# Altium schematic sheet Connectors.SchDoc: Extension connectors
size A3; DocumentNumber: MB1312; Revision: A-01; SheetNumber: 5; SheetTotal: 6; Project: NUCLEO-LXXXZX
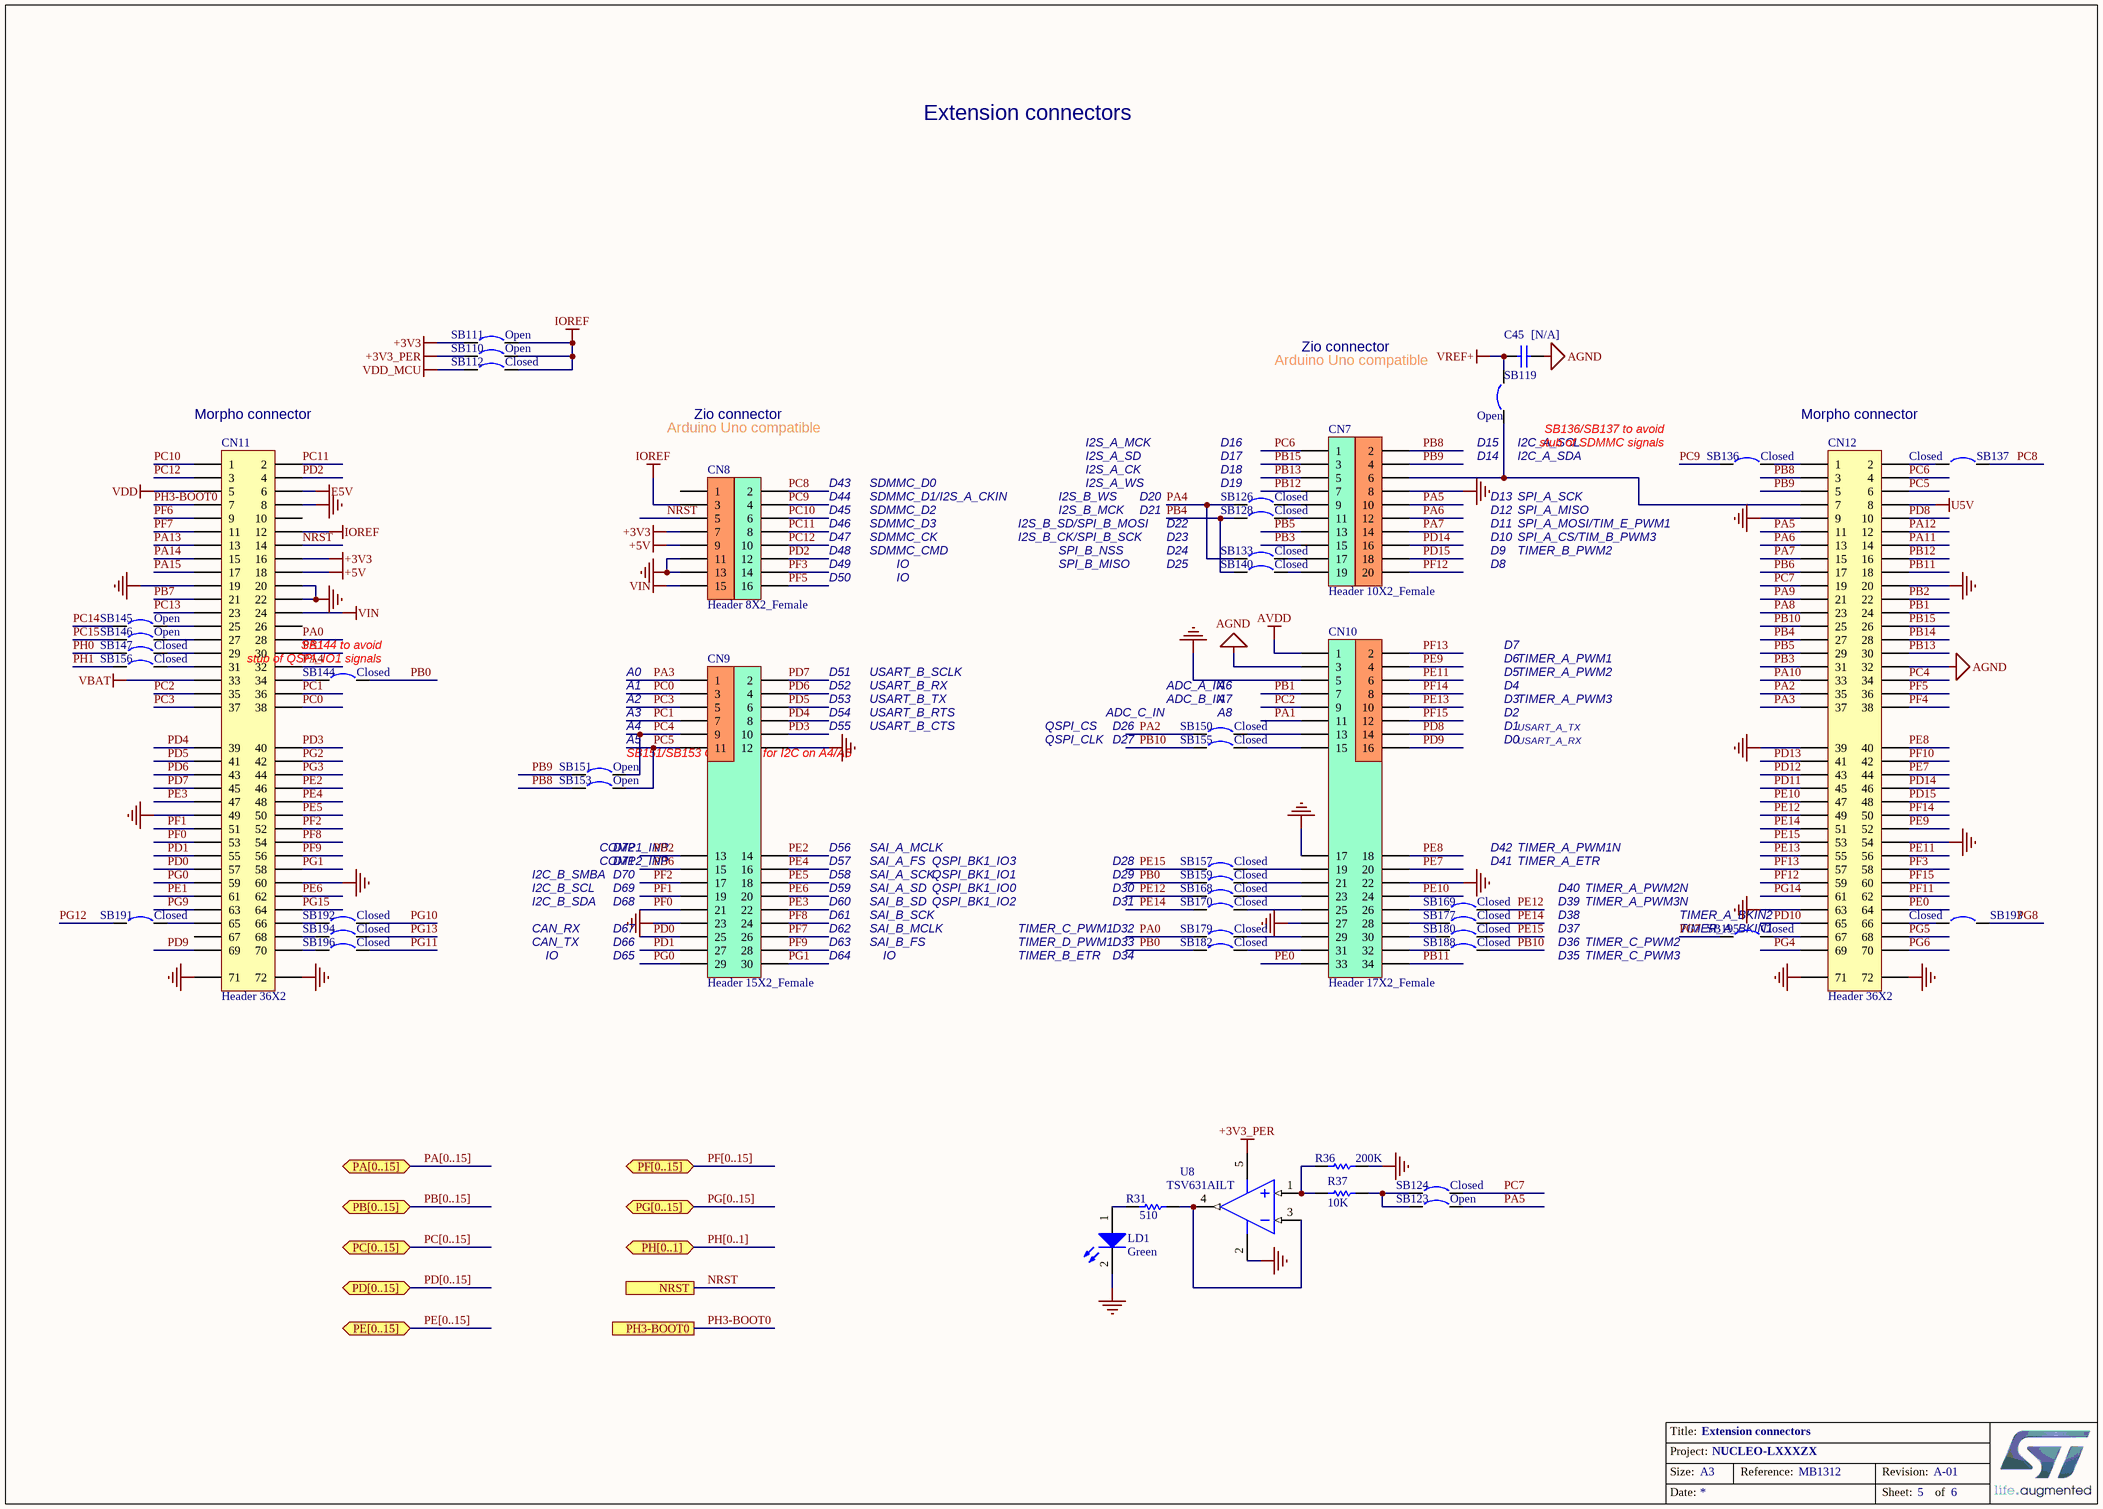
[diagram p0: Connectors.SchDoc]

## Parts
C45  [N/A]  [0603C]
CN7  Header 10X2_Female  [HDR_10x2_2R54_V_F]
CN8  Header 8X2_Female  [HDR_8x2_2R54_V_F]
CN9  Header 15X2_Female  [HDR_15x2_2R54_V_F]
CN10  Header 17X2_Female  [HDR_17x2_2R54_V_F]
CN11  Header 36X2  [HDR_2x36_2R54_V_M]
CN12  Header 36X2  [HDR_2x36_2R54_V_M]
LD1  Green  [0603D-G]
R31  510  [0603R]
R36  200K  [0603R]
R37  10K  [0603R]
SB110  Open  [SB_0603]
SB111  Open  [SB_0603]
SB112  Closed  [SB_0603]
SB119  Open  [SB_0603]
SB123  Open  [SB_0603]
SB124  Closed  [SB_0603]
SB126  Closed  [SB_0603]
SB128  Closed  [SB_0603]
SB133  Closed  [SB_0603]
SB136  Closed  [SB_0603]
SB137  Closed  [SB_0603]
SB140  Closed  [SB_0603]
SB144  Closed  [SB_0603]
SB145  Open  [SB_0603]
SB146  Open  [SB_0603]
SB147  Closed  [SB_0603]
SB150  Closed  [SB_0603]
SB151  Open  [SB_0603]
SB153  Open  [SB_0603]
SB155  Closed  [SB_0603]
SB156  Closed  [SB_0603]
SB157  Closed  [SB_0603]
SB159  Closed  [SB_0603]
SB168  Closed  [SB_0603]
SB169  Closed  [SB_0603]
SB170  Closed  [SB_0603]
SB177  Closed  [SB_0603]
SB179  Closed  [SB_0603]
SB180  Closed  [SB_0603]
SB182  Closed  [SB_0603]
SB188  Closed  [SB_0603]
SB191  Closed  [SB_0603]
SB192  Closed  [SB_0603]
SB193  Closed  [SB_0603]
SB194  Closed  [SB_0603]
SB195  Closed  [SB_0603]
SB196  Closed  [SB_0603]
U8  TSV631AILT  [SOT-23-5L]

## Ports
NRST, PA[0..15] (bidir), PB[0..15] (bidir), PC[0..15] (bidir), PD[0..15] (bidir), PE[0..15] (bidir), PF[0..15] (bidir), PG[0..15] (bidir), PH3-BOOT0, PH[0..1] (bidir)

## Nets
+3V3: CN8.7 CN11.16 SB111.1
+3V3_PER: SB110.1 U8.5(VCC)
+5V: CN8.9 CN11.18
AGND: C45.2 CN10.3 CN12.32
AVDD: CN10.1
E5V: CN11.6
GND: CN7.8 CN8.11 CN8.13 CN9.12 CN9.23 CN10.5 CN10.17 CN10.22 CN10.27 CN11.8 CN11.19 CN11.20 CN11.22 CN11.49 CN11.60 CN11.71 CN11.72 CN12.9 CN12.20 CN12.39 CN12.54 CN12.63 CN12.71 CN12.72 LD1.2(K) R36.2 U8.2(VDD)
IOREF: CN8.3 CN11.12 SB110.2 SB111.2 SB112.2
U5V: CN12.8
VBAT: CN11.33
VDD: CN11.5
VDD_MCU: SB112.1
VIN: CN8.15 CN11.24
VREF+: C45.1 SB119.1
NRST: CN8.5 CN11.14 ; port NRST
PA0: CN11.28 SB179.1
PA1: CN10.11 CN11.30
PA2: CN12.35 SB150.1
PA3: CN9.1 CN12.37
PA4: CN11.32 SB126.1 SB133.1
PA5: CN7.10 CN12.11 SB123.2
PA6: CN7.12 CN12.13
PA7: CN7.14 CN12.15
PA8: CN12.23
PA9: CN12.21
PA10: CN12.33
PA11: CN12.14
PA12: CN12.12
PA13: CN11.13
PA14: CN11.15
PA15: CN11.17
PB0: SB144.2 SB159.1 SB182.1
PB1: CN10.7 CN12.24
PB2: CN9.13 CN12.22
PB3: CN7.15 CN12.31
PB4: CN12.27 SB128.1 SB140.1
PB5: CN7.13 CN12.29
PB6: CN9.15 CN12.17
PB7: CN11.21
PB8: CN7.2 CN12.3 SB153.2
PB9: CN7.4 CN12.5 SB151.2
PB10: CN12.25 SB155.1 SB188.2
PB11: CN10.34 CN12.18
PB12: CN7.7 CN12.16
PB13: CN7.5 CN12.30
PB14: CN12.28
PB15: CN7.3 CN12.26
PC0: CN9.3 CN11.38
PC1: CN9.7 CN11.36
PC2: CN10.9 CN11.35
PC3: CN9.5 CN11.37
PC4: CN9.9 CN12.34 SB151.1
PC5: CN9.11 CN12.6 SB153.1
PC6: CN7.1 CN12.4
PC7: CN12.19 SB124.1
PC8: CN8.2 SB137.1
PC9: CN8.4 SB136.1
PC10: CN8.6 CN11.1
PC11: CN8.8 CN11.2
PC12: CN8.10 CN11.3
PC13: CN11.23
PC14: SB145.1
PC15: SB146.1
PD0: CN9.25 CN11.57
PD1: CN9.27 CN11.55
PD2: CN8.12 CN11.4
PD3: CN9.10 CN11.40
PD4: CN9.8 CN11.39
PD5: CN9.6 CN11.41
PD6: CN9.4 CN11.43
PD7: CN9.2 CN11.45
PD8: CN10.14 CN12.10
PD9: CN10.16 CN11.69
PD10: CN12.65
PD11: CN12.45
PD12: CN12.43
PD13: CN12.41
PD14: CN7.16 CN12.46
PD15: CN7.18 CN12.48
PE0: CN10.33 CN12.64
PE1: CN11.61
PE2: CN9.14 CN11.46
PE3: CN9.22 CN11.47
PE4: CN9.16 CN11.48
PE5: CN9.18 CN11.50
PE6: CN9.20 CN11.62
PE7: CN10.20 CN12.44
PE8: CN10.18 CN12.40
PE9: CN10.4 CN12.52
PE10: CN10.24 CN12.47
PE11: CN10.6 CN12.56
PE12: CN12.49 SB168.1 SB169.2
PE13: CN10.10 CN12.55
PE14: CN12.51 SB170.1 SB177.2
PE15: CN12.53 SB157.1 SB180.2
PF0: CN9.21 CN11.53
PF1: CN9.19 CN11.51
PF2: CN9.17 CN11.52
PF3: CN8.14 CN12.58
PF4: CN12.38
PF5: CN8.16 CN12.36
PF6: CN11.9
PF7: CN9.26 CN11.11
PF8: CN9.24 CN11.54
PF9: CN9.28 CN11.56
PF10: CN12.42
PF11: CN12.62
PF12: CN7.20 CN12.59
PF13: CN10.2 CN12.57
PF14: CN10.8 CN12.50
PF15: CN10.12 CN12.60
PG0: CN9.29 CN11.59
PG1: CN9.30 CN11.58
PG2: CN11.42
PG3: CN11.44
PG4: CN12.69
PG5: CN12.68
PG6: CN12.70
PG7: SB195.1
PG8: SB193.2
PG9: CN11.63
PG10: SB192.2
PG11: SB196.2
PG12: SB191.1
PG13: SB194.2
PG14: CN12.61
PG15: CN11.64
PH0: SB147.1
PH1: SB156.1
PH3-BOOT0: CN11.7 ; port PH3-BOOT0
NetCN7_6: CN7.6 CN12.7 SB119.2
NetCN7_9: CN7.9 SB126.2
NetCN7_11: CN7.11 SB128.2
NetCN7_17: CN7.17 SB133.2
NetCN7_19: CN7.19 SB140.2
NetCN10_13: CN10.13 SB150.2
NetCN10_15: CN10.15 SB155.2
NetCN10_19: CN10.19 SB157.2
NetCN10_21: CN10.21 SB159.2
NetCN10_23: CN10.23 SB168.2
NetCN10_25: CN10.25 SB170.2
NetCN10_26: CN10.26 SB169.1
NetCN10_28: CN10.28 SB177.1
NetCN10_29: CN10.29 SB179.2
NetCN10_30: CN10.30 SB180.1
NetCN10_31: CN10.31 SB182.2
NetCN10_32: CN10.32 SB188.1
NetCN11_25: CN11.25 SB145.2
NetCN11_27: CN11.27 SB146.2
NetCN11_29: CN11.29 SB147.2
NetCN11_31: CN11.31 SB156.2
NetCN11_34: CN11.34 SB144.1
NetCN11_65: CN11.65 SB191.2
NetCN11_66: CN11.66 SB192.1
NetCN11_68: CN11.68 SB194.1
NetCN11_70: CN11.70 SB196.1
NetCN12_1: CN12.1 SB136.2
NetCN12_2: CN12.2 SB137.2
NetCN12_66: CN12.66 SB193.1
NetCN12_67: CN12.67 SB195.2
NetLD1_1: LD1.1(A) R31.2
NetR31_1: R31.1 U8.3(IN-) U8.4(OUT)
NetR36_1: R36.1 R37.1 U8.1(IN+)
NetR37_2: R37.2 SB123.1 SB124.2

Not connected (* = marked no-connect by the designer): CN8 1; CN11 10 26 67

## Buses and harness runs
bus PA[0..15] = port PA[0..15]
bus PB[0..15] = port PB[0..15]
bus PC[0..15] = port PC[0..15]
bus PD[0..15] = port PD[0..15]
bus PE[0..15] = port PE[0..15]
bus PF[0..15] = port PF[0..15]
bus PG[0..15] = port PG[0..15]
bus PH[0..1] = port PH[0..1]

## Notes on the sheet
- Extension connectors
- Arduino Uno compatible
- Zio connector
- (near CN11) Morpho connector
- I2S_A_MCK
- D16
- (near SB119) D15
- (near SB119) I2C_A_SCL
- (near SB136) SB136/SB137 to avoid
- (near SB136) stub of SDMMC signals
- Morpho connector
- D43
- D44
- D45
- SDMMC_D0
- SDMMC_D1/I2S_A_CKIN
- SDMMC_D2
- I2S_B_WS
- I2S_B_MCK
- I2S_A_SD
- I2S_A_CK
- I2S_A_WS
- D20
- D21
- D17
- D18
- (near SB126) D19
- (near SB119) D14
- D13
- D12
- SPI_A_SCK
- SPI_A_MISO
- (near SB119) I2C_A_SDA
- D46
- D47
- D48
- D49
- D50
- SDMMC_CK
- SDMMC_CMD
- SDMMC_D3
- IO
- I2S_B_SD/SPI_B_MOSI
- I2S_B_CK/SPI_B_SCK
- SPI_B_MISO
- SPI_B_NSS
- D22
- D23
- D24
- D25
- D8
- D9
- D10
- D11
- TIMER_B_PWM2
- SPI_A_CS/TIM_B_PWM3
- SPI_A_MOSI/TIM_E_PWM1
- (near SB144) SB144 to avoid
- D7
- (near SB144) stub of QSPI_IO1 signals
- A0
- A1
- A2
- A3
- D51
- D52
- D53
- D54
- USART_B_TX
- USART_B_RX
- USART_B_SCLK
- USART_B_RTS
- ADC_A_IN
- ADC_B_IN
- (near SB150) ADC_C_IN
- A6
- A7
- (near SB150) A8
- D2
- D4
- D3
- D5
- D6
- TIMER_A_PWM1
- TIMER_A_PWM2
- TIMER_A_PWM3
- A4
- A5
- (near SB151) SB151/SB153 Close only for I2C on A4/A5
- D55
- USART_B_CTS
- QSPI_CLK
- QSPI_CS
- D26
- D27
- D0
- D1
- USART_A_TX
- USART_A_RX
- COMP1_INP
- D72
- D56
- SAI_A_MCLK
- D42
- TIMER_A_PWM1N
- I2C_B_SCL
- I2C_B_SDA
- I2C_B_SMBA
- COMP2_INP
- D71
- D70
- D69
- D68
- D57
- D58
- D59
- D60
- D61
- SAI_A_SD
- SAI_A_SCK
- SAI_A_FS
- SAI_B_SD
- SAI_B_SCK
- QSPI_BK1_IO0
- QSPI_BK1_IO2
- QSPI_BK1_IO1
- QSPI_BK1_IO3
- D28
- D29
- D30
- D31
- D41
- TIMER_A_ETR
- D38
- D39
- D40
- TIMER_A_PWM2N
- TIMER_A_PWM3N
- TIMER_A_BKIN2
- CAN_TX
- CAN_RX
- D67
- D66
- D65
- D62
- D63
- D64
- SAI_B_FS
- SAI_B_MCLK
- TIMER_D_PWM1
- TIMER_B_ETR
- TIMER_C_PWM1
- D32
- D33
- D34
- D35
- D36
- D37
- TIMER_C_PWM2
- TIMER_C_PWM3
- TIMER_A_BKIN1
- Title:
- Project:
- Size:
- Date:
- Reference:
- Sheet:
- Revision:
- of

## Library data of the parts
C45 = Cap: Capacitor,100nF,10%,16V,X7R,0603,YAGEO; Manuf_Part_1: CC0603KRX7R7BB104; Ordered by: Subcon; Published: 8-Jun-2000; Revision: July-2002: Re-released for DXP Platform.; Publisher: Altium Limited; Value: 100nF; Manuf_1: YAGEO
CN7 = Header 10X2_Female: Header, 10-Pin, Dual row,female; LatestRevisionDate: 17-Jul-2002; LatestRevisionNote: Re-released for DXP Platform.; Publisher: Altium Limited
CN8 = Header 8X2_Female: Header, 8-Pin, Dual row,female; LatestRevisionDate: 17-Jul-2002; LatestRevisionNote: Re-released for DXP Platform.; Publisher: Altium Limited
CN9 = Header 15X2_Female: Header, 15-Pin, Dual row,female; Revision: 17-Jul-2002: Re-released for DXP Platform.; Publisher: Altium Limited
CN10 = Header 17X2_Female: Header, 17-Pin, Dual row,female; Revision: 17-Jul-2002: Re-released for DXP Platform.; Publisher: Altium Limited
CN11 CN12 = Header 36X2: Header, 36-Pin, Dual row; System: Connector; Revision: 17-Jul-2002: Re-released for DXP Platform.; Publisher: Altium Limited
LD1 = LED2: Typical RED, GREEN, YELLOW, AMBER GaAs LED; Published: 8-Jun-2000; Revision: July-2002: Re-released for DXP Platform.; Publisher: Altium Limited
R31 = Res1: Resistor; Value: 1K; Published: 8-Jun-2000; Revision: July-2002: Re-released for DXP Platform.; Publisher: Altium Limited
R36 R37 = res1: Resistor; Value: 1K; Published: 8-Jun-2000; Revision: July-2002: Re-released for DXP Platform.; Publisher: Altium Limited
SB110 SB111 SB119 SB123 SB145 SB146 SB151 SB153 = Circuit Breaker: Published: 24-Mar-1999; Revision: July-2002: Re-released for DXP Platform.; Publisher: Altium Limited
SB112 SB124 SB126 SB128 SB133 SB136 SB137 SB140 SB144 SB147 SB150 SB155-SB157 SB159 SB168-SB170 SB177 SB179 SB180 SB182 SB188 SB191-SB196 = Circuit Breaker_close: Circuit Breaker; Published: 24-Mar-1999; Revision: July-2002: Re-released for DXP Platform.; Publisher: Altium Limited